# EasyEDA schematic lora.json
TITLE: Sheet_1; REV: 1.0; Date: 2022-05-01; Sheet: 1/1; Drawn By: Jingxi_Zhu; Company: Your Company
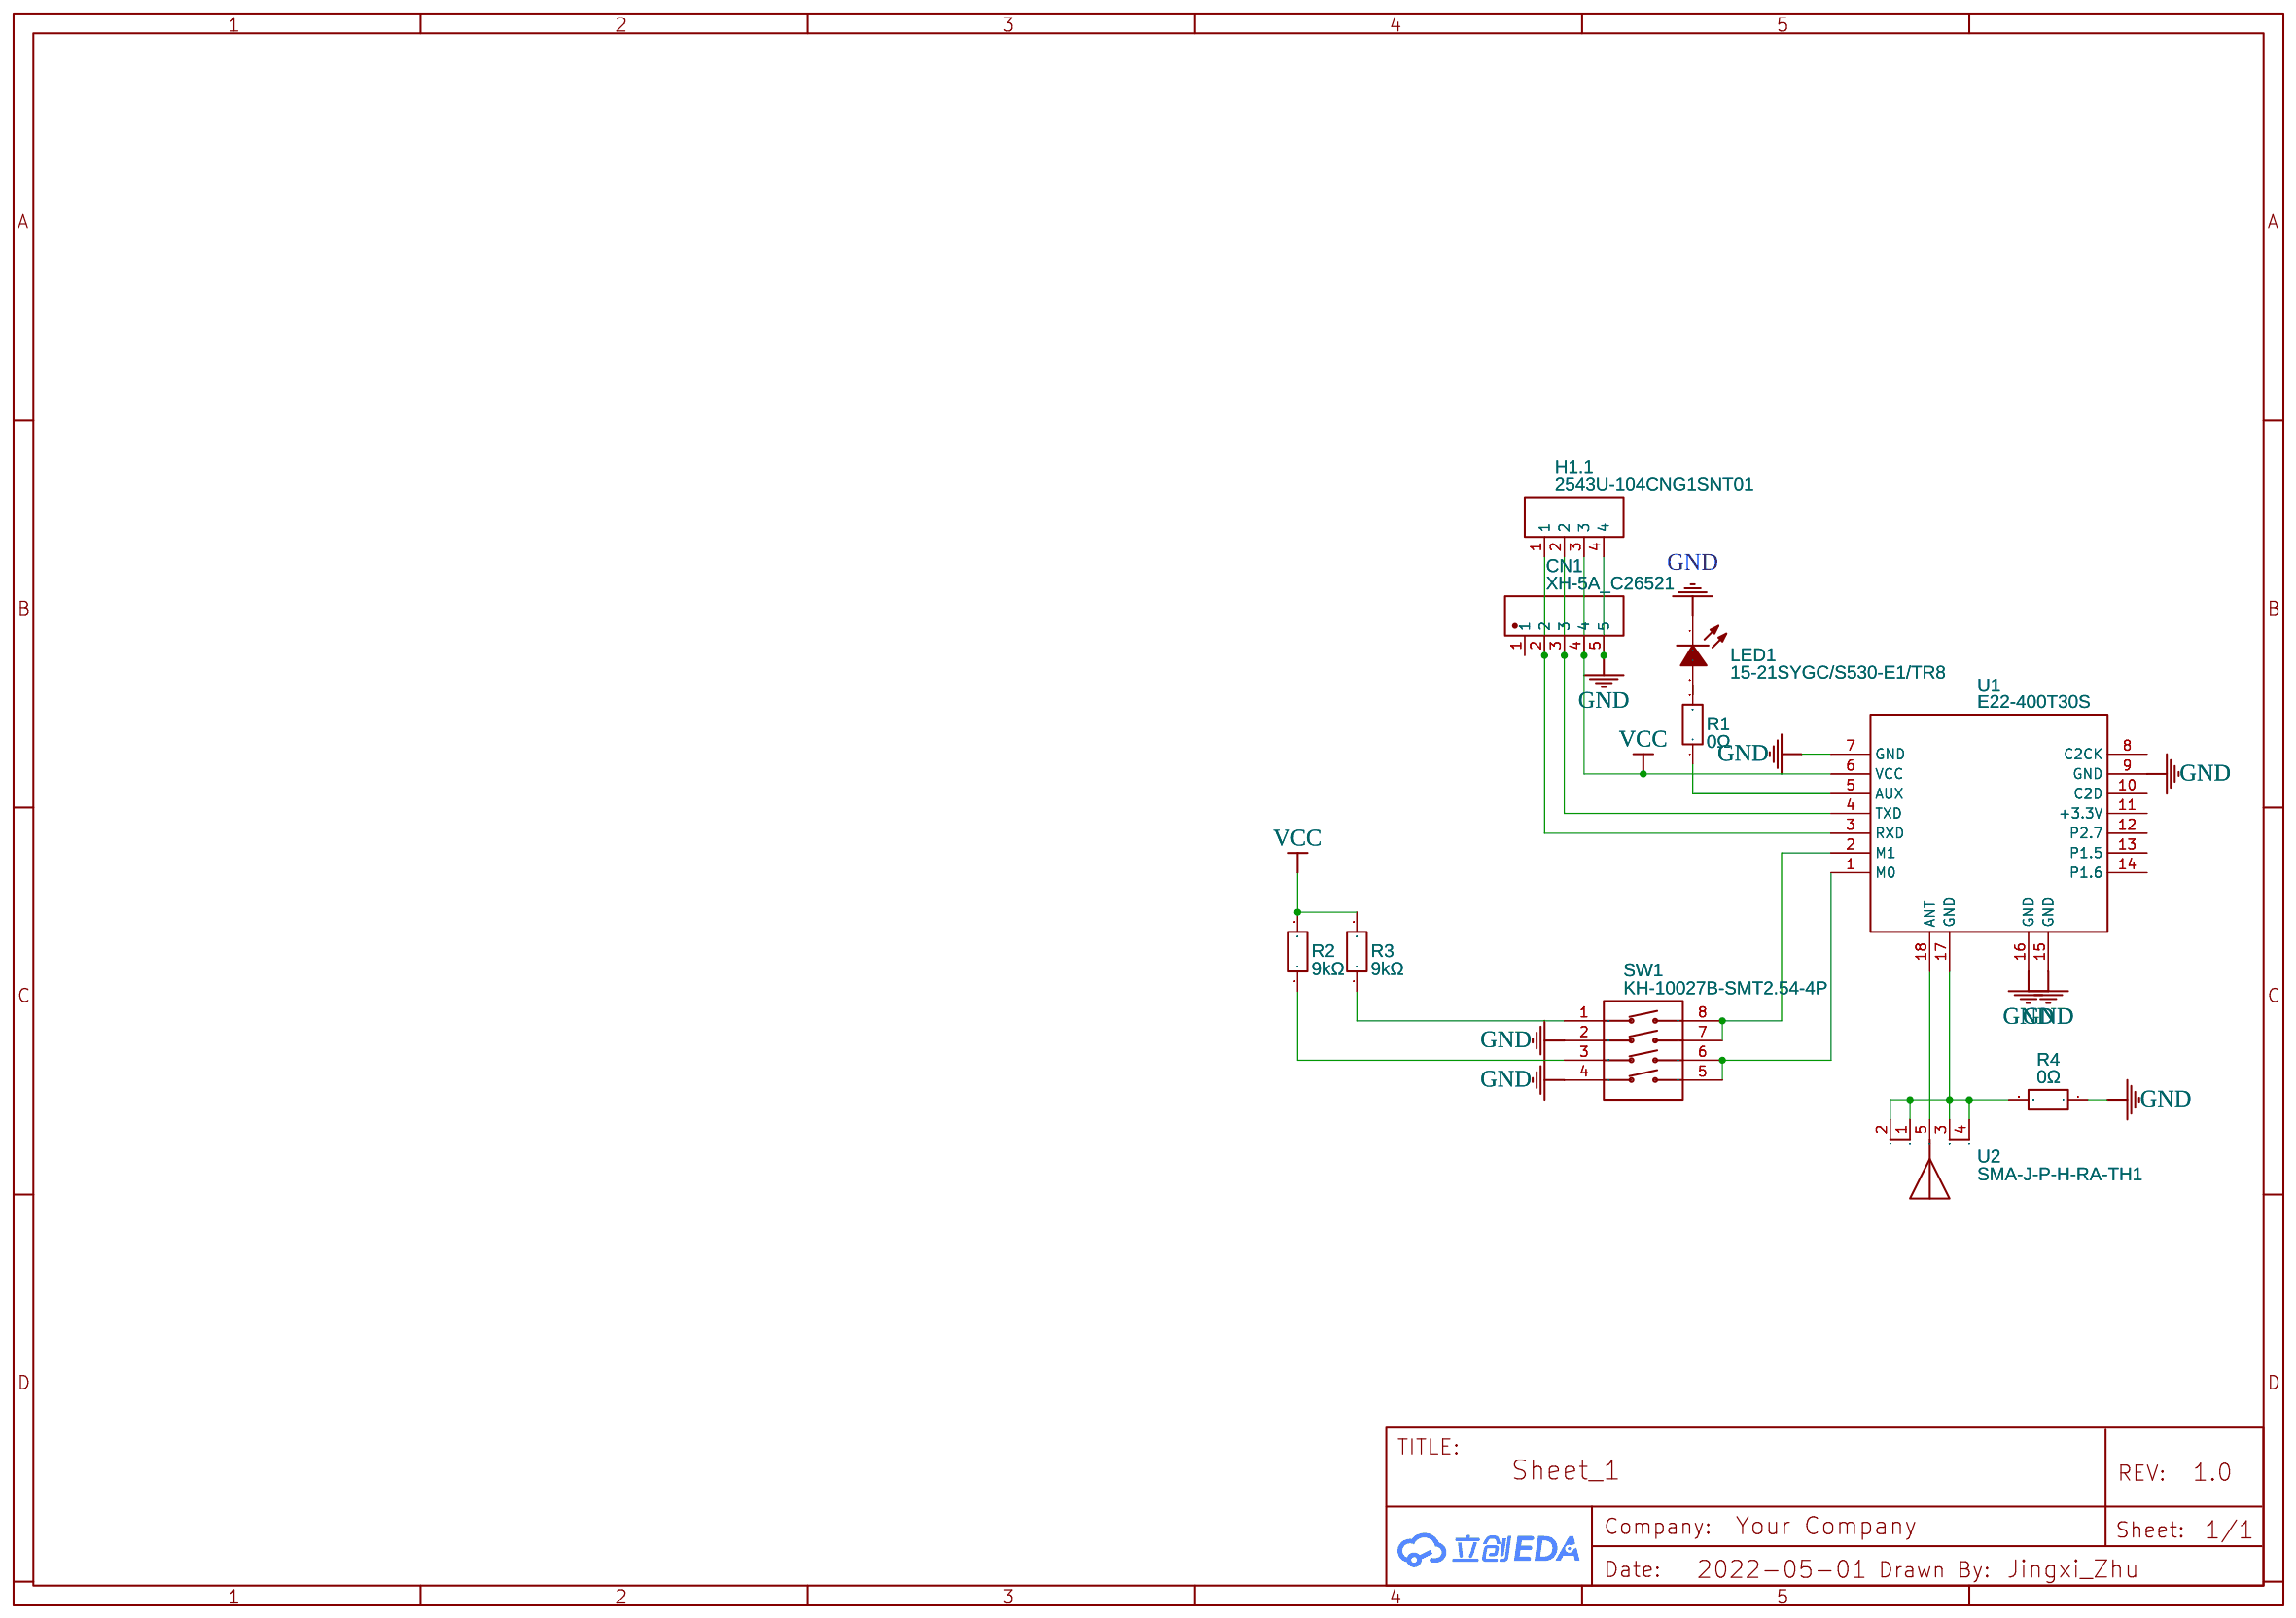
[diagram p0: schematic sheet]

## Parts
CN1  XH-5A_C26521  [CONN-TH_5P-P2.50_XH-5A]
H1  2543U-104CNG1SNT01  [HDR-TH_4P-P2.00-V-F]  (section 1)
LED1  15-21SYGC/S530-E1/TR8  [LED1206-RD_GREEN]
R1  0Ω  [R0805]
R2  9kΩ  [R0603]
R3  9kΩ  [R0603]
R4  0Ω  [R0805]
SW1  KH-10027B-SMT2.54-4P  [SW-SMD_KINGHELM_KH-10027B-SMT2.54-4P]
U1  E22-400T30S  [WIRELM-SMD_E22-400T30S]
U2  SMA-J-P-H-RA-TH1  [ANT-TH_SMA-J-P-H-RA-TH1]

## Library data of the parts
CN1 = XH-5A_C26521: Supplier Part: C26521; Supplier: LCSC; Manufacturer: ReliaPro; Manufacturer Part: XH-5A; JLCPCB Part Class: Extended Part
H1 = 2543U-104CNG1SNT01: Supplier: LCSC; Supplier Part: C350271; Manufacturer: 华宇创; Contributor: LCSC; JLCPCB Part Class: Extended Part; subpart_no: 1
LED1 = 15-21SYGC/S530-E1/TR8: Supplier: LCSC; Supplier Part: C409439; Manufacturer: Everlight Elec; Contributor: LCSC; JLCPCB Part Class: Extended Part
R1 R4 = ACE05000JT: Supplier: LCSC; Supplier Part: C343926; Manufacturer: Guangdong Fenghua Advanced Tech; Resistance (Ohms): 0; Contributor: LCSC; JLCPCB Part Class: Extended Part
R2 R3 = 0603WAF9001T5E: Supplier: LCSC; Supplier Part: C407505; Manufacturer: Uniroyal Elec; Resistance (Ohms): 9K; Contributor: LCSC; JLCPCB Part Class: Extended Part
SW1 = KH-10027B-SMT2.54-4P: Supplier: LCSC; Supplier Part: C2842911; Manufacturer: kinghelm(金航标); Contributor: LCSC; JLCPCB Part Class: Extended Part
U1 = E22-400T30S: Supplier: LCSC; Supplier Part: C411288; Manufacturer: Chengdu Ebyte Elec Tech; Contributor: LCSC; JLCPCB Part Class: Extended Part
U2 = SMA-J-P-H-RA-TH1: Supplier: LCSC; Supplier Part: C9900002359; Manufacturer: null; JLCPCB Part Class: Extended Part; Contributor: LCSC

## Nets
GND: CN1.5 H1.4 LED1.1(-) R4.1 SW1.2 SW1.4 U1.7(GND) U1.9(GND) U1.15(GND) U1.16(GND)
VCC: CN1.4 H1.3 R2.2 R3.2 U1.6(VCC)
Net-(CN1-2): CN1.2 H1.1 U1.3(RXD)
Net-(CN1-3): CN1.3 H1.2 U1.4(TXD)
Net-(LED1-2): LED1.2(+) R1.2
Net-(R1-1): R1.1 U1.5(AUX)
Net-(R2-1): R2.1 SW1.3
Net-(R3-1): R3.1 SW1.1
Net-(R4-2): R4.2 U1.17(GND) U2.1 U2.2 U2.3 U2.4
Net-(SW1-5): SW1.5 SW1.6 U1.1(M0)
Net-(SW1-7): SW1.7 SW1.8 U1.2(M1)
Net-(U1-18): U1.18(ANT) U2.5

Not connected (* = marked no-connect by the designer): CN1 1; U1 8(C2CK) 10(C2D) 11(+3.3V) 12(P2.7) 13(P1.5) 14(P1.6)
